# EAGLE schematic OpenTherm_Board_77X (EAGLE 9.6.2)

## Sheet 1 of 7
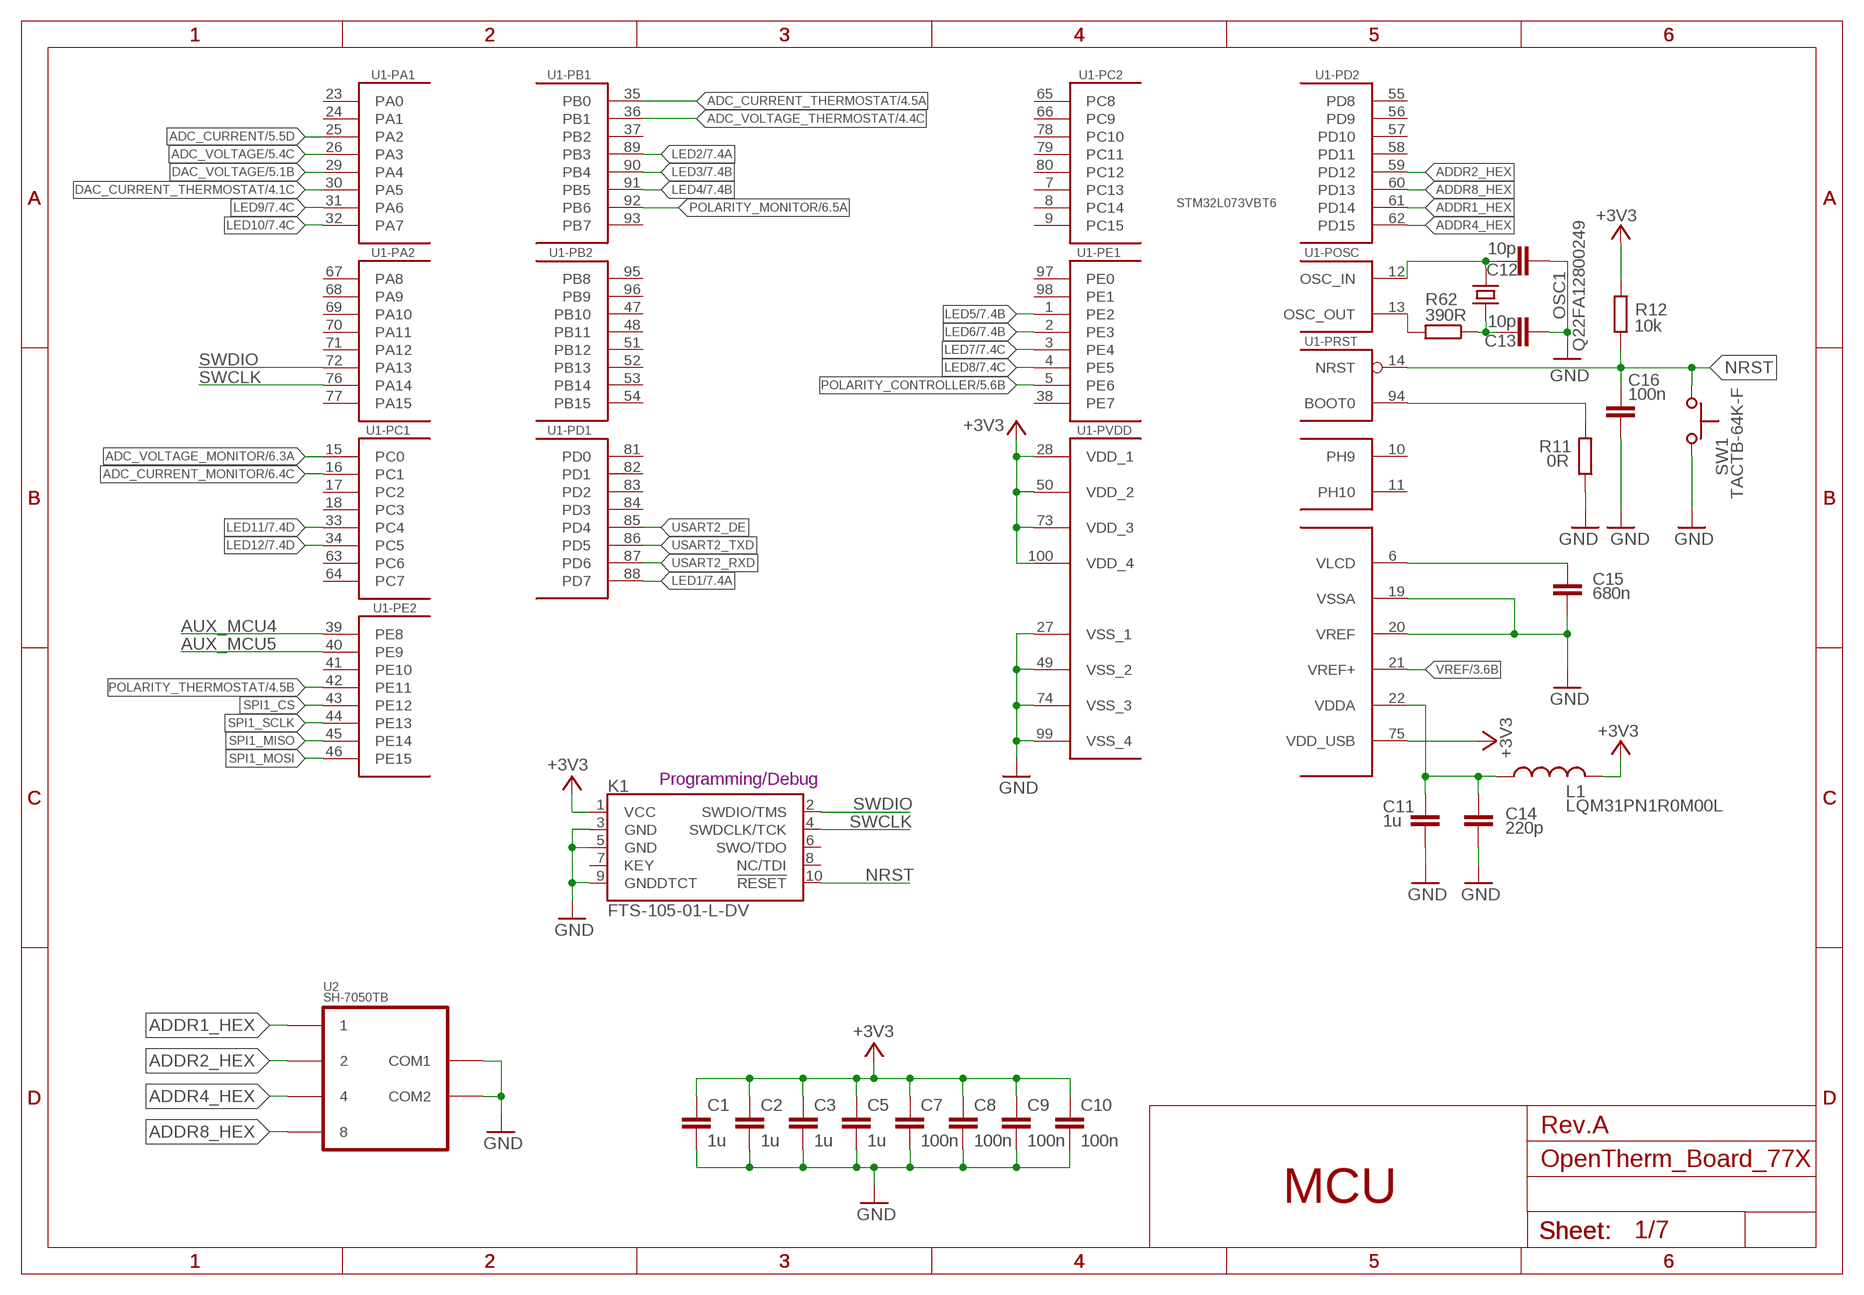
[diagram p0: schematic, sheet 1]

### Parts
C1  1u  C-EUC0805  [C0805]
C2  1u  C-EUC0805  [C0805]
C3  1u  C-EUC0805  [C0805]
C5  1u  C-EUC0805  [C0805]
C7  100n  C-EUC0603  [C0603]
C8  100n  C-EUC0603  [C0603]
C9  100n  C-EUC0603  [C0603]
C10  100n  C-EUC0603  [C0603]
C11  1u  C-EUC0805  [C0805]
C12  10p  C-EUC0603  [C0603]
C13  10p  C-EUC0603  [C0603]
C14  220p  C-EUC0603  [C0603]
C15  680n  C-EUC0603  [C0603:1]
C16  100n  C-EUC0603  [C0603]
K1  FTS-105-01-L-DV  CORTEX_DEBUG_SMD  [SAMTECH_FTSH-105-01]
L1  LQM31PN1R0M00L  L-US  [R1206]
OSC1  Q22FA12800249  [OSCILATOR]
R11  0R  R-EU_R0603  [R0603]
R12  10k  R-EU_R0603  [R0603]
R62  390R  R-EU_R0603  [R0603]
SW1  TACTB-64K-F  [TACTB-64K-F]
U1  STM32L073VBT6  [TQFP100]
U2  SH-7050TB  [HEX_DEC]

### Nets
+3V3: C1.1 C2.1 C3.1 C5.1 C7.1 C8.1 C9.1 C10.1 K1.1(VCC) L1.2 R12.2 U1.28(-PVDD:VDD_1) U1.50(-PVDD:VDD_2) U1.73(-PVDD:VDD_3) U1.75(-PVCC:VDD_USB) U1.100(-PVDD:VDD_4) ; also sheet 2,3,4,5,6,7
ADC_CURRENT: U1.25(-PA1:PA2) ; also sheet 5
ADC_CURRENT_MONITOR: U1.16(-PC1:PC1) ; also sheet 6
ADC_CURRENT_THERMOSTAT: U1.35(-PB1:PB0) ; also sheet 4
ADC_VOLTAGE: U1.26(-PA1:PA3) ; also sheet 5
ADC_VOLTAGE_MONITOR: U1.15(-PC1:PC0) ; also sheet 6
ADC_VOLTAGE_THERMOSTAT: U1.36(-PB1:PB1) ; also sheet 4
ADDR1_HEX: U1.61(-PD2:PD14) U2.1
ADDR2_HEX: U1.59(-PD2:PD12) U2.2
ADDR4_HEX: U1.62(-PD2:PD15) U2.4
ADDR8_HEX: U1.60(-PD2:PD13) U2.8
AUX_MCU4: U1.39(-PE2:PE8)
AUX_MCU5: U1.40(-PE2:PE9)
BOOT: R11.2 U1.94(-PRST:BOOT0)
DAC_CURRENT_THERMOSTAT: U1.30(-PA1:PA5) ; also sheet 4
DAC_VOLTAGE: U1.29(-PA1:PA4) ; also sheet 5
GND: C1.2 C2.2 C3.2 C5.2 C7.2 C8.2 C9.2 C10.2 C11.2 C12.2 C13.2 C14.2 C15.2 C16.2 K1.3(GND) K1.5(GND) K1.9(GNDDTCT) R11.1 SW1.3 U1.19(-PVCC:VSSA) U1.20(-PVCC:VREF) U1.27(-PVDD:VSS_1) U1.49(-PVDD:VSS_2) U1.74(-PVDD:VSS_3) U1.99(-PVDD:VSS_4) U2.C1(COM1) U2.C2(COM2) ; also sheet 2,3,4,5,6
LED1: U1.88(-PD1:PD7) ; also sheet 7
LED2: U1.89(-PB1:PB3) ; also sheet 7
LED3: U1.90(-PB1:PB4) ; also sheet 7
LED4: U1.91(-PB1:PB5) ; also sheet 7
LED5: U1.1(-PE1:PE2) ; also sheet 7
LED6: U1.2(-PE1:PE3) ; also sheet 7
LED7: U1.3(-PE1:PE4) ; also sheet 7
LED8: U1.4(-PE1:PE5) ; also sheet 7
LED9: U1.31(-PA1:PA6) ; also sheet 7
LED10: U1.32(-PA1:PA7) ; also sheet 7
LED11: U1.33(-PC1:PC4) ; also sheet 7
LED12: U1.34(-PC1:PC5) ; also sheet 7
N$2: C15.1 U1.6(-PVCC:VLCD)
NRST: C16.1 K1.10(!RESET) R12.1 SW1.1 U1.14(-PRST:NRST)
OSC: C13.1 OSC1.3 R62.1
OSC+: C12.1 OSC1.1 U1.12(-POSC:OSC_IN)
OSC-: R62.2 U1.13(-POSC:OSC_OUT)
POLARITY_CONTROLLER: U1.5(-PE1:PE6) ; also sheet 5
POLARITY_MONITOR: U1.92(-PB1:PB6) ; also sheet 6
POLARITY_THERMOSTAT: U1.42(-PE2:PE11) ; also sheet 4
SPI1_CS: U1.43(-PE2:PE12)
SPI1_MISO: U1.45(-PE2:PE14)
SPI1_MOSI: U1.46(-PE2:PE15)
SPI1_SCLK: U1.44(-PE2:PE13)
SWCLK: K1.4(SWDCLK/TCK) U1.76(-PA2:PA14)
SWDIO: K1.2(SWDIO/TMS) U1.72(-PA2:PA13)
USART2_DE: U1.85(-PD1:PD4) ; also sheet 2
USART2_RXD: U1.87(-PD1:PD6) ; also sheet 2
USART2_TXD: U1.86(-PD1:PD5) ; also sheet 2
VDDA: C11.1 C14.1 L1.1 U1.22(-PVCC:VDDA)
VREF: U1.21(-PVCC:VREF+) ; also sheet 3,6
Unconnected: K1.6(SWO/TDO) K1.7(KEY) K1.8(NC/TDI) SW1.2(1A) SW1.4(2A) U1.7(-PC2:PC13) U1.8(-PC2:PC14) U1.9(-PC2:PC15) U1.10(-PH:PH9) U1.11(-PH:PH10) U1.17(-PC1:PC2) U1.18(-PC1:PC3) U1.23(-PA1:PA0) U1.24(-PA1:PA1) U1.37(-PB1:PB2) U1.38(-PE1:PE7) U1.41(-PE2:PE10) U1.47(-PB2:PB10) U1.48(-PB2:PB11) U1.51(-PB2:PB12) U1.52(-PB2:PB13) U1.53(-PB2:PB14) U1.54(-PB2:PB15) U1.55(-PD2:PD8) U1.56(-PD2:PD9) U1.57(-PD2:PD10) U1.58(-PD2:PD11) U1.63(-PC1:PC6) U1.64(-PC1:PC7) U1.65(-PC2:PC8) U1.66(-PC2:PC9) U1.67(-PA2:PA8) U1.68(-PA2:PA9) U1.69(-PA2:PA10) U1.70(-PA2:PA11) U1.71(-PA2:PA12) U1.77(-PA2:PA15) U1.78(-PC2:PC10) U1.79(-PC2:PC11) U1.80(-PC2:PC12) U1.81(-PD1:PD0) U1.82(-PD1:PD1) U1.83(-PD1:PD2) U1.84(-PD1:PD3) U1.93(-PB1:PB7) U1.95(-PB2:PB8) U1.96(-PB2:PB9) U1.97(-PE1:PE0) U1.98(-PE1:PE1)

### Notes on the sheet
- Programming/Debug
- Rev.A
- MCU

## Sheet 2 of 7
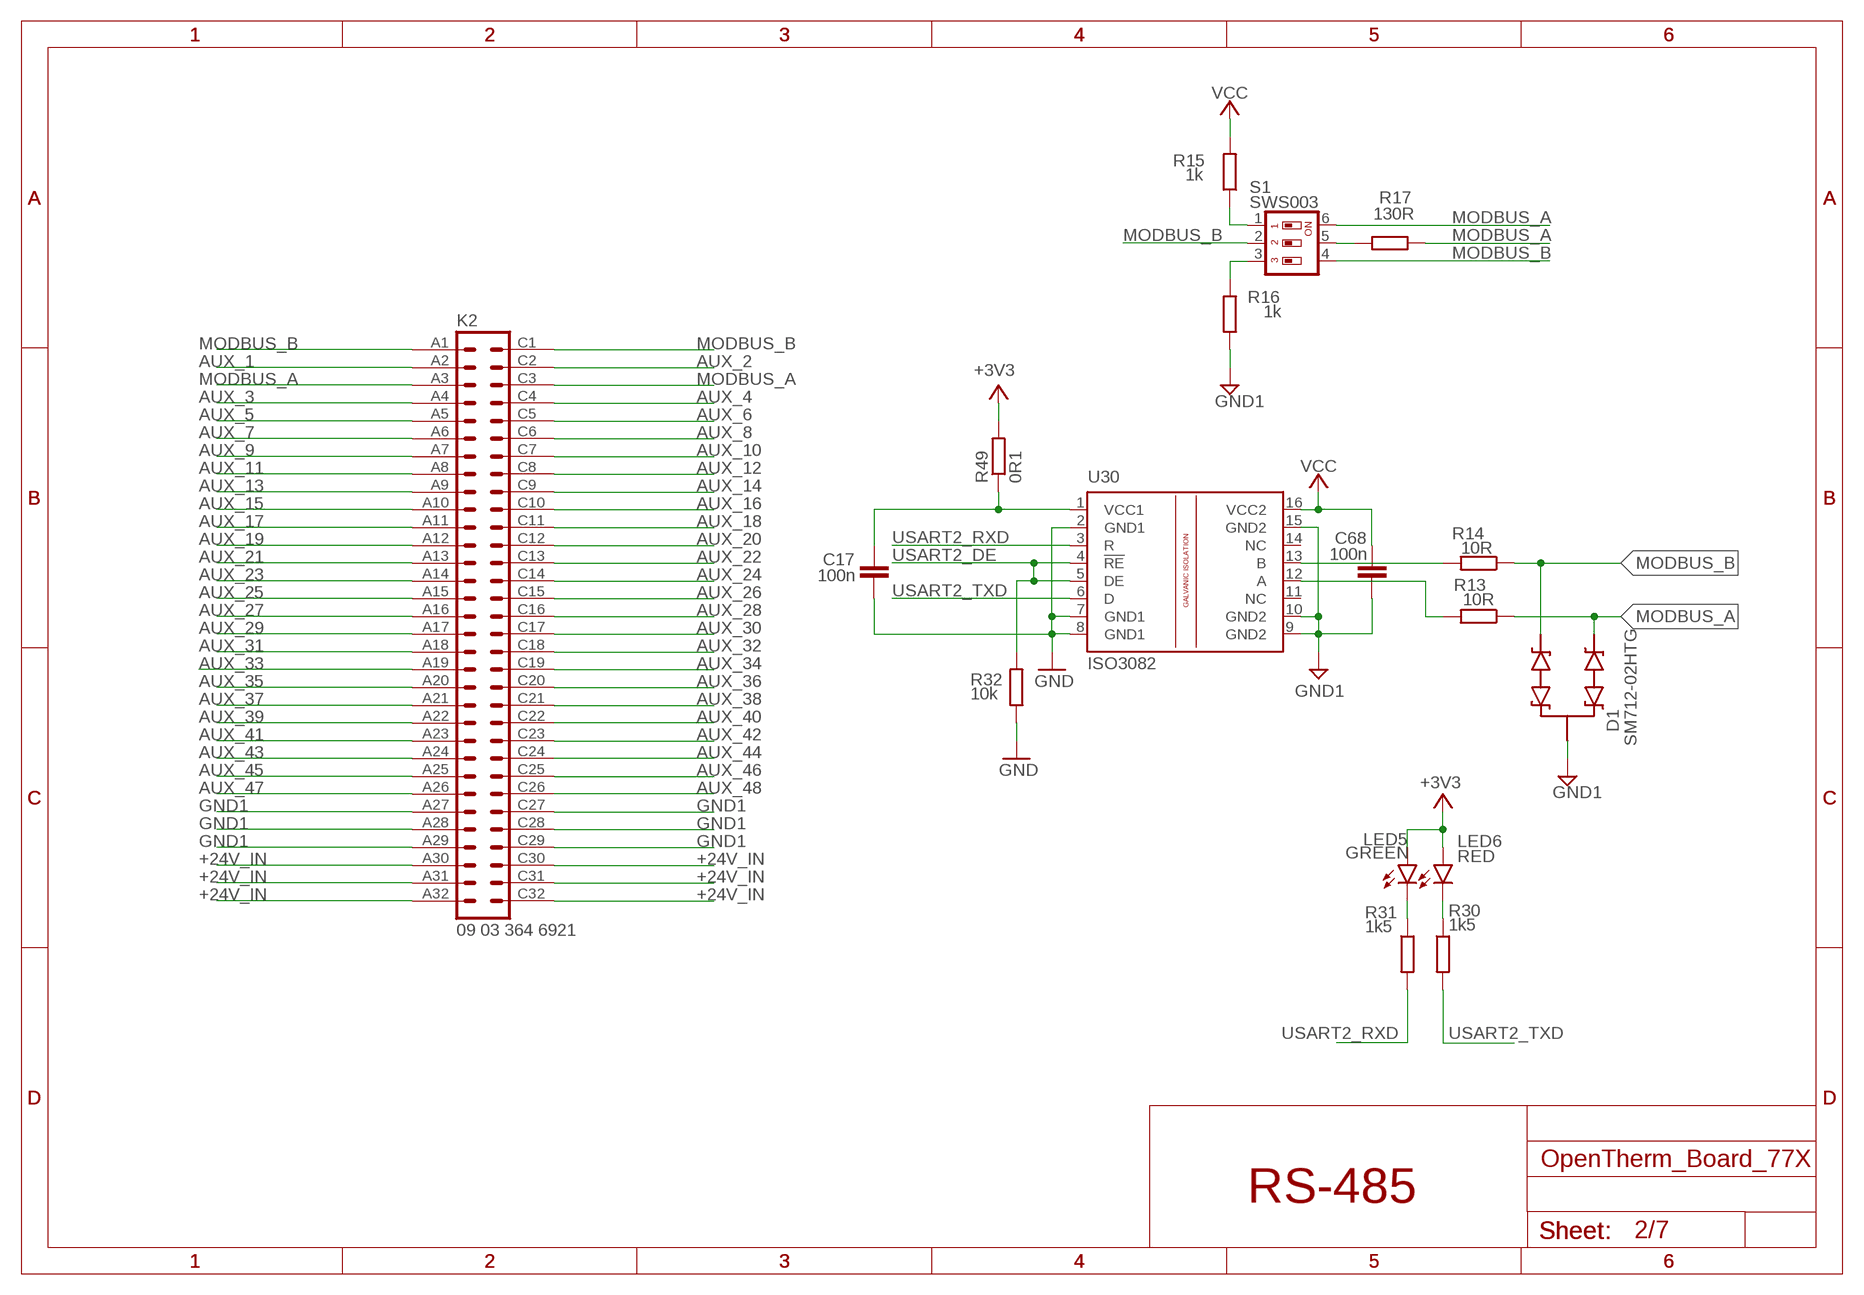
[diagram p1: schematic, sheet 2]

### Parts
C17  100n  C-EUC0805  [C0805]
C68  100n  C-EUC0805  [C0805]
D1  SM712-02HTG  [SOT23-BEC]
K2  09 03 364 6921  VG64P  [VG64P]
LED5  GREEN  LEDCHIPLED_1206  [CHIPLED_1206]
LED6  RED  LEDCHIPLED_1206  [CHIPLED_1206]
R13  10R  R-EU_R0603  [R0603]
R14  10R  R-EU_R0603  [R0603]
R15  1k  R-EU_R1206  [R1206]
R16  1k  R-EU_R1206  [R1206]
R17  130R  R-EU_R1206  [R1206]
R30  1k5  R-EU_R1206  [R1206]
R31  1k5  R-EU_R1206  [R1206]
R32  10k  R-EU_R0603  [R0603]
R49  0R1  R-EU_R1206  [R1206]
S1  SWS003  [SMS-003]
U30  ISO3082  [SO-16DW]

### Nets
+3V3: LED5.A LED6.A R49.2 ; also sheet 1,3,4,5,6,7
+24V_IN: K2.A30 K2.A31 K2.A32 K2.C30 K2.C31 K2.C32 ; also sheet 3
AUX_1: K2.A2
AUX_2: K2.C2
AUX_3: K2.A4
AUX_4: K2.C4
AUX_5: K2.A5
AUX_6: K2.C5
AUX_7: K2.A6
AUX_8: K2.C6
AUX_9: K2.A7
AUX_10: K2.C7
AUX_11: K2.A8
AUX_12: K2.C8
AUX_13: K2.A9
AUX_14: K2.C9
AUX_15: K2.A10
AUX_16: K2.C10
AUX_17: K2.A11
AUX_18: K2.C11
AUX_19: K2.A12
AUX_20: K2.C12
AUX_21: K2.A13
AUX_22: K2.C13
AUX_23: K2.A14
AUX_24: K2.C14
AUX_25: K2.A15
AUX_26: K2.C15
AUX_27: K2.A16
AUX_28: K2.C16
AUX_29: K2.A17
AUX_30: K2.C17
AUX_31: K2.A18
AUX_32: K2.C18
AUX_33: K2.A19
AUX_34: K2.C19
AUX_35: K2.A20
AUX_36: K2.C20
AUX_37: K2.A21
AUX_38: K2.C21
AUX_39: K2.A22
AUX_40: K2.C22
AUX_41: K2.A23
AUX_42: K2.C23
AUX_43: K2.A24
AUX_44: K2.C24
AUX_45: K2.A25
AUX_46: K2.C25
AUX_47: K2.A26
AUX_48: K2.C26
GND: C17.2 R32.1 U30.2(GND1) U30.7(GND1) U30.8(GND1) ; also sheet 1,3,4,5,6
GND1: C68.2 D1.C(E) K2.A27 K2.A28 K2.A29 K2.C27 K2.C28 K2.C29 R16.1 U30.9(GND2) U30.10(GND2) U30.15(GND2) ; also sheet 3
MODBUS_A: D1.E K2.A3 K2.C3 R13.1 R17.1 S1.6
MODBUS_B: D1.B K2.A1 K2.C1 R14.1 S1.2 S1.4
N$7: R14.2 U30.13(B)
N$20: LED5.C R31.1
N$23: R13.2 U30.12(A)
N$34: R15.1 S1.1
N$35: R16.2 S1.3
N$36: R17.2 S1.5
N$37: LED6.C R30.1
N$67: C17.1 R49.1 U30.1(VCC1)
USART2_DE: R32.2 U30.4(!RE) U30.5(DE) ; also sheet 1
USART2_RXD: R31.2 U30.3(R) ; also sheet 1
USART2_TXD: R30.2 U30.6(D) ; also sheet 1
VCC: C68.1 R15.2 U30.16(VCC2) ; also sheet 3
Unconnected: U30.11(NC) U30.14(NC)

### Notes on the sheet
- RS-485

## Sheet 3 of 7
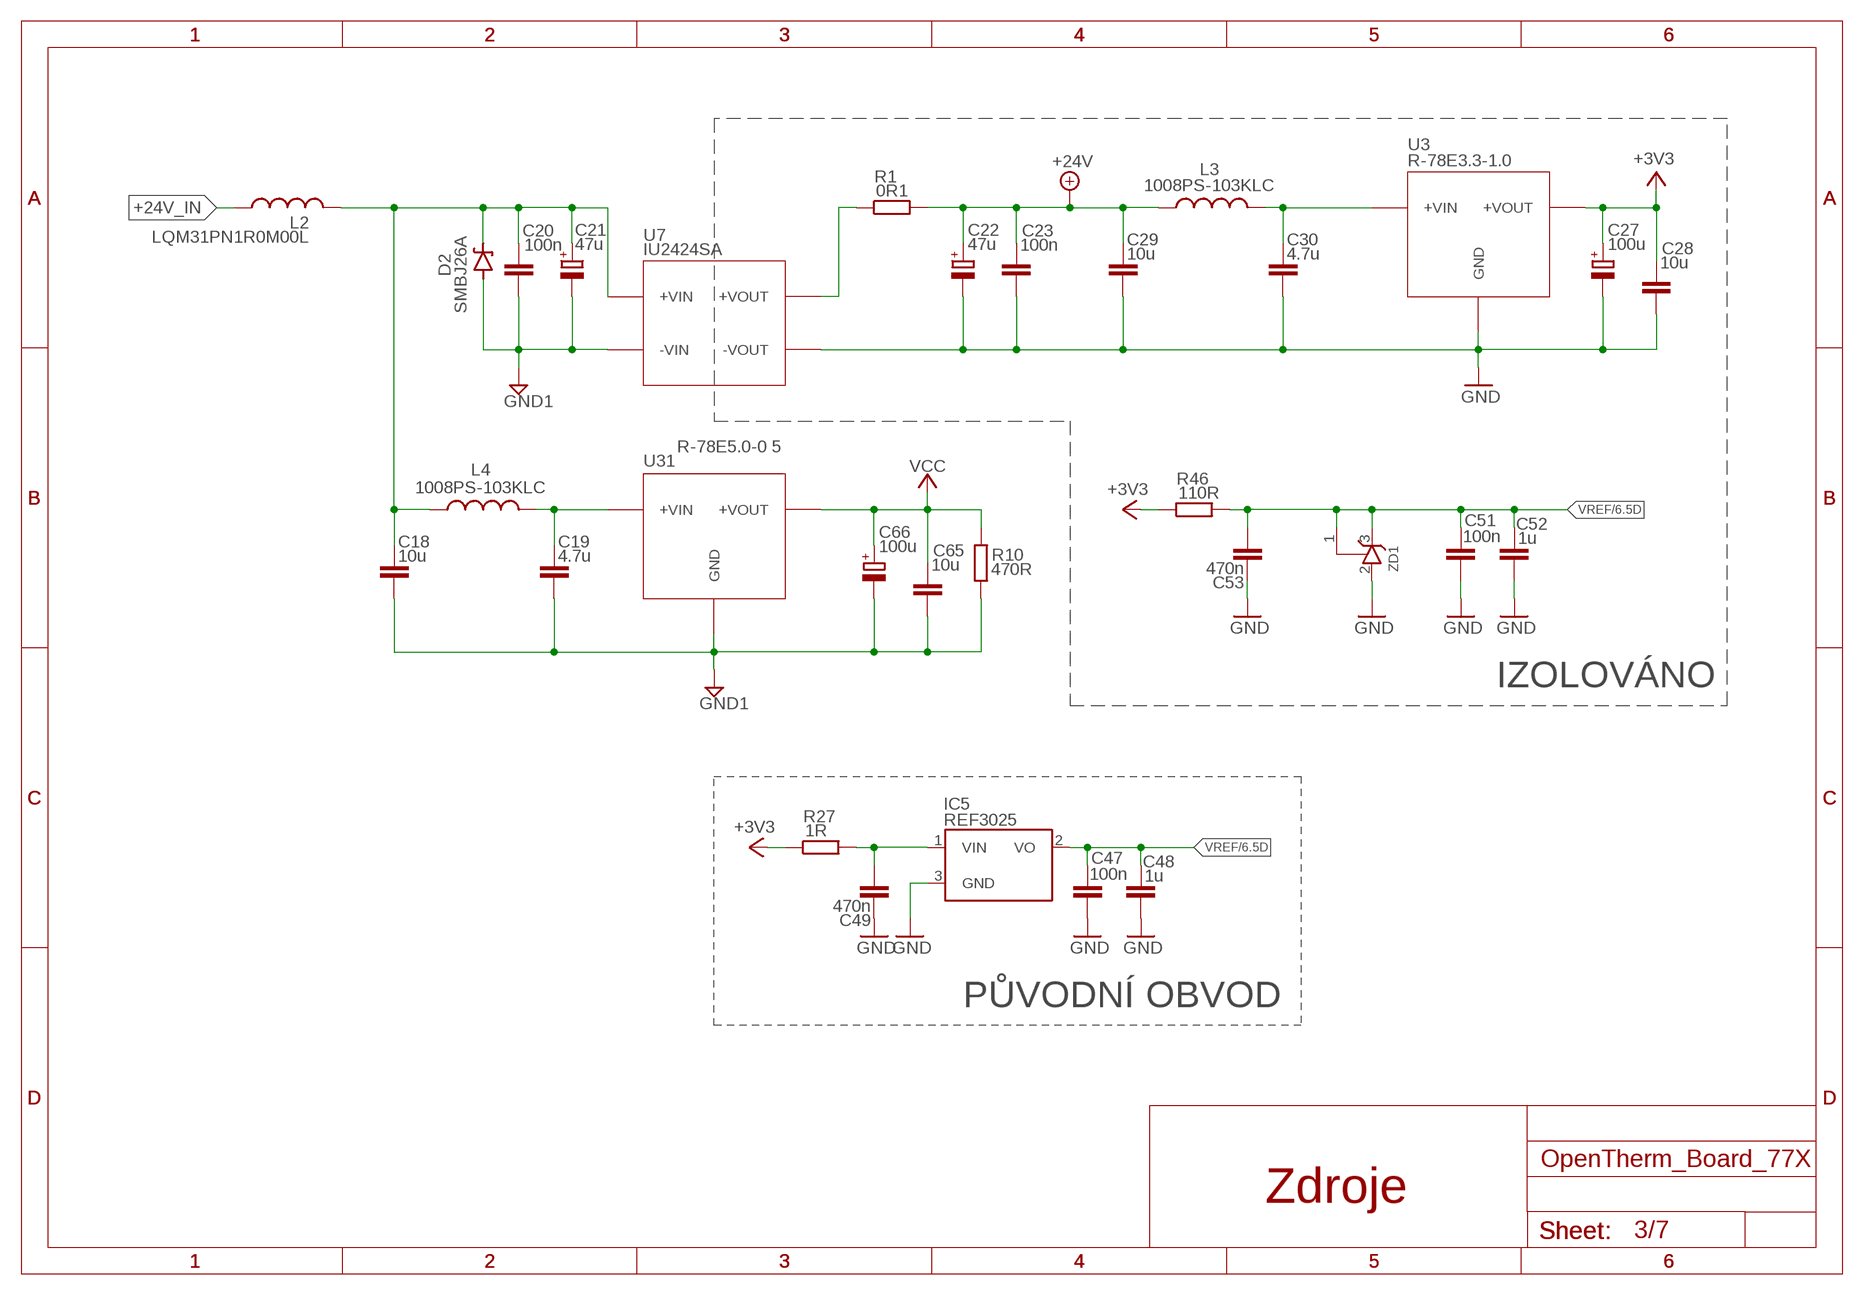
[diagram p2: schematic, sheet 3]

### Parts
C18  10u  C-EUC1206  [C1206]
C19  4.7u  C-EUC1206  [C1206]
C20  100n  C-EUC1206  [C1206]
C21  47u  CPOL-EUE3.5-8  [E3,5-8]
C22  47u  CPOL-EU153CLV-0810  [153CLV-0810]
C23  100n  C-EUC0805  [C0805]
C27  100u  CPOL-EU153CLV-0605  [153CLV-0605]
C28  10u  C-EUC1206  [C1206]
C29  10u  C-EUC1206  [C1206]
C30  4.7u  C-EUC1206  [C1206]
C47  100n  C-EUC0805  [C0805]
C48  1u  C-EUC0805  [C0805]
C49  470n  C-EUC0805  [C0805]
C51  100n  C-EUC0805  [C0805]
C52  1u  C-EUC0805  [C0805]
C53  470n  C-EUC0805  [C0805]
C65  10u  C-EUC1206  [C1206]
C66  100u  CPOL-EU153CLV-0605  [153CLV-0605]
D2  SMBJ26A  [SMB]
IC5  REF3025  MC1525TT  [SOT23]
L2  LQM31PN1R0M00L  L-US  [R1206]
L3  1008PS-103KLC  L-USL1812:1  [L1812]
L4  1008PS-103KLC  L-USL1812:1  [L1812]
R1  0R1  R-EU_R1206  [R1206]
R10  470R  R-EU_R1206  [R1206]
R27  1R  R-EU_R0805  [R0805]
R46  110R  R-EU_R0805  [R0805]
U3  R-78E3.3-1.0  R-78E-0.5  [R-78E-0.5]
U7  IU2424SA  IU2405SA  [IU2405SA]
U31  R-78E5.0-0 5  R-78E-0.5  [R-78E-0.5]
ZD1  TL431INLINE  [TO92-R]

### Nets
+3V3: C27.+ C28.1 R27.1 R46.1 U3.3(+VOUT) ; also sheet 1,2,4,5,6,7
+24V: C22.+ C23.1 C29.1 L3.1 R1.2 ; also sheet 4,5
+24V_IN: L2.1 ; also sheet 2
GND: C22.- C23.2 C27.- C28.2 C29.2 C30.2 C47.2 C48.2 C49.1 C51.2 C52.2 C53.1 IC5.3(GND) U3.2(GND) U7.VOUT-(-VOUT) ZD1.2(A) ; also sheet 1,2,4,5,6
GND1: C18.2 C19.2 C20.2 C21.- C65.2 C66.- D2.A R10.1 U7.VIN-(-VIN) U31.2(GND) ; also sheet 2
N$14: C18.1 C20.1 C21.+ D2.C L2.2 L4.1 U7.VIN+(+VIN)
N$16: C30.1 L3.2 U3.1(+VIN)
N$17: C49.2 IC5.1(VIN) R27.2
N$19: R1.1 U7.VOUT+(+VOUT)
N$63: C19.1 L4.2 U31.1(+VIN)
VCC: C65.1 C66.+ R10.2 U31.3(+VOUT) ; also sheet 2
VREF: C47.1 C48.1 C51.1 C52.1 C53.2 IC5.2(VO) R46.2 ZD1.1(R) ZD1.3(C) ; also sheet 1,6

### Notes on the sheet
- R-78E3.3-1.0
- IU2424SA
- R-78E5.0-0 5
- IZOLOVÁNO
- PŮVODNÍ OBVOD
- Zdroje

## Sheet 4 of 7
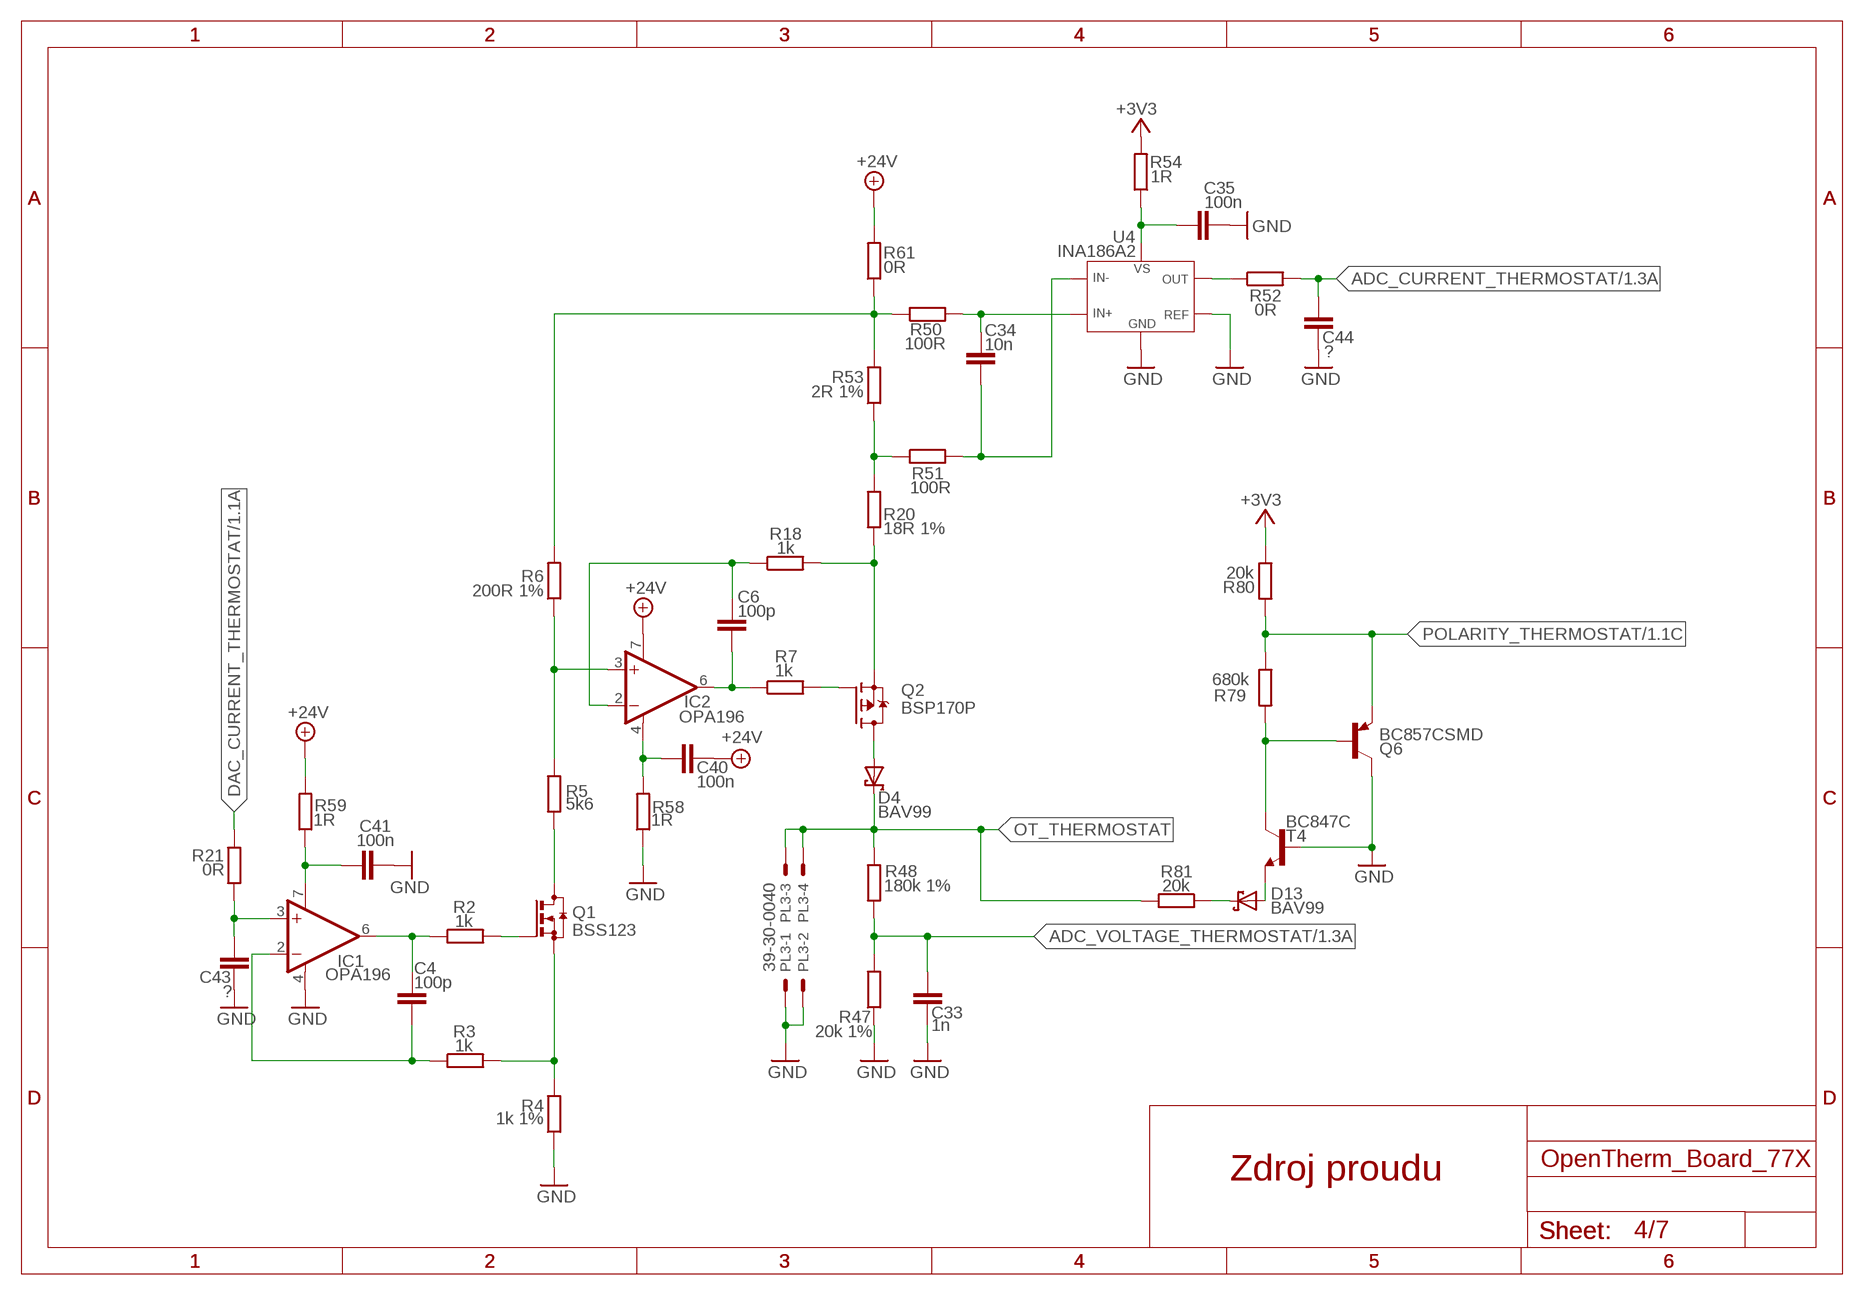
[diagram p3: schematic, sheet 4]

### Parts
C4  100p  C-EUC0805  [C0805]
C6  100p  C-EUC0805  [C0805]
C33  1n  C-EUC0805  [C0805]
C34  10n  C-EUC0805  [C0805]
C35  100n  C-EUC0805  [C0805]
C40  100n  C-EUC0805  [C0805]
C41  100n  C-EUC0805  [C0805]
C43  ?  C-EUC0805  [C0805]
C44  ?  C-EUC0805  [C0805]
D4  BAV99  BAS70  [SOT23]
D13  BAV99  BAS70  [SOT23]
IC1  OPA196  OPA340U  [SO08]
IC2  OPA196  OPA340U  [SO08]
PL3  39-30-0040  555X-4H  [5569-4]
Q1  BSS123  [SOT23]
Q2  BSP170P  [SOT223]
Q6  BC857CSMD  [SOT23-BEC]
R2  1k  R-EU_R0805  [R0805]
R3  1k  R-EU_R0805  [R0805]
R4  1k 1%  R-EU_R0805  [R0805]
R5  5k6  R-EU_R0805  [R0805]
R6  200R 1%  R-EU_R0805  [R0805]
R7  1k  R-EU_R0805  [R0805]
R18  1k  R-EU_R0805  [R0805]
R20  18R 1%  R-EU_R1206  [R1206]
R21  0R  R-EU_R1206  [R1206]
R47  20k 1%  R-EU_R0805  [R0805]
R48  180k 1%  R-EU_R0805  [R0805]
R50  100R  R-EU_R0805  [R0805]
R51  100R  R-EU_R0805  [R0805]
R52  0R  R-EU_R1206  [R1206]
R53  2R 1%  R-EU_R1206  [R1206]
R54  1R  R-EU_R0805  [R0805]
R58  1R  R-EU_R0805  [R0805]
R59  1R  R-EU_R0805  [R0805]
R61  0R  R-EU_R1206  [R1206]
R79  680k  R-EU_R0805  [R0805]
R80  20k  R-EU_R0805  [R0805]
R81  20k  R-EU_R0805  [R0805]
T4  BC847C  BC847  [SOT23]
U4  INA186A2  [SC70-6L]

### Nets
+3V3: R54.2 R80.1 ; also sheet 1,2,3,5,6,7
+24V: C40.1 IC2.7(V+) R59.2 R61.2 ; also sheet 3,5
ADC_CURRENT_THERMOSTAT: C44.1 R52.2 ; also sheet 1
ADC_VOLTAGE_THERMOSTAT: C33.1 R47.2 R48.1 ; also sheet 1
DAC_CURRENT_THERMOSTAT: R21.1 ; also sheet 1
GND: C33.2 C35.2 C41.2 C43.1 C44.2 IC1.4(V-) PL3.1 PL3.2 Q6.C R4.1 R47.1 R58.1 T4.1(B) U4.1(REF) U4.2(GND) ; also sheet 1,2,3,5,6
N$1: IC2.3(+IN) R5.2 R6.1
N$3: Q1.3(D) R5.1
N$4: D4.1(A) Q2.2(D) Q2.4(D)
N$5: Q1.2(S) R3.2 R4.2
N$6: Q1.1(G) R2.2
N$8: C4.1 IC1.6(OUT) R2.1
N$9: C4.2 IC1.2(-IN) R3.1
N$10: C6.2 IC2.6(OUT) R7.1
N$11: C6.1 IC2.2(-IN) R18.1
N$12: Q2.3(S) R18.2 R20.1
N$13: Q2.1(G) R7.2
N$15: C43.2 IC1.3(+IN) R21.2
N$32: R6.2 R50.1 R53.2 R61.1
N$33: C34.1 R50.2 U4.4(IN+)
N$42: C34.2 R51.2 U4.5(IN-)
N$43: R20.2 R51.1 R53.1
N$44: R52.1 U4.6(OUT)
N$45: C35.1 R54.1 U4.3(VS)
N$51: C40.2 IC2.4(V-) R58.2
N$52: C41.1 IC1.7(V+) R59.1
N$74: Q6.B R79.2 T4.3(C)
N$75: D13.1(A) T4.2(E)
N$76: D13.3(C) R81.1
OT_THERMOSTAT: D4.3(C) PL3.3 PL3.4 R48.2 R81.2
POLARITY_THERMOSTAT: Q6.E R79.1 R80.2 ; also sheet 1

### Notes on the sheet
- Zdroj proudu

## Sheet 5 of 7
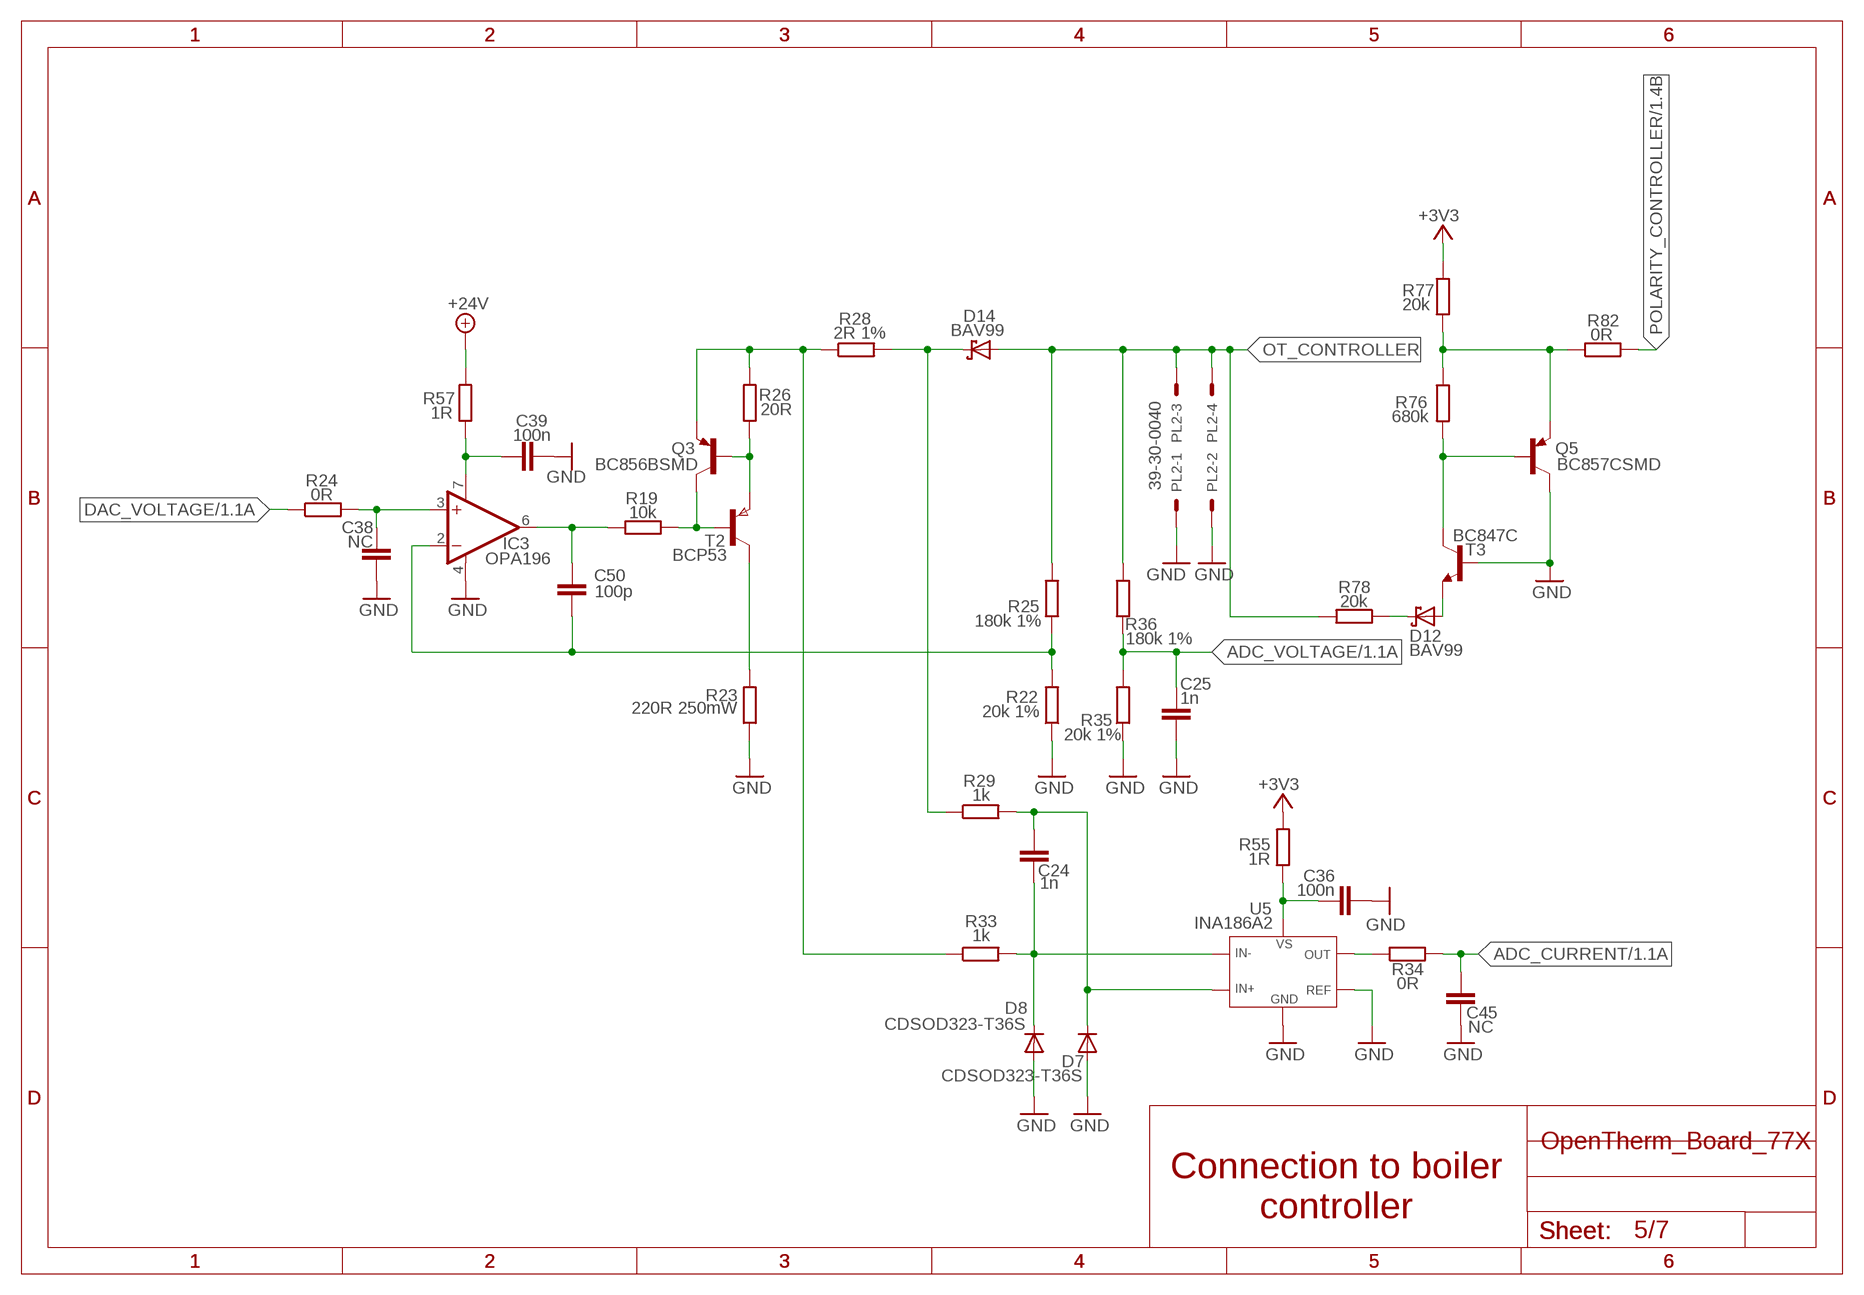
[diagram p4: schematic, sheet 5]

### Parts
C24  1n  C-EUC0805  [C0805]
C25  1n  C-EUC0805  [C0805]
C36  100n  C-EUC0805  [C0805]
C38  NC  C-EUC0805  [C0805]
C39  100n  C-EUC0805  [C0805]
C45  NC  C-EUC0805  [C0805]
C50  100p  C-EUC0805  [C0805]
D7  CDSOD323-T36S  DIODE-SOD323-W  [SOD323-W]
D8  CDSOD323-T36S  DIODE-SOD323-W  [SOD323-W]
D12  BAV99  BAS70  [SOT23]
D14  BAV99  BAS70  [SOT23]
IC3  OPA196  OPA340U  [SO08]
PL2  39-30-0040  555X-4H  [5569-4]
Q3  BC856BSMD  [SOT23-BEC]
Q5  BC857CSMD  [SOT23-BEC]
R19  10k  R-EU_R0805  [R0805]
R22  20k 1%  R-EU_R0805  [R0805]
R23  220R 250mW  R-EU_R1206  [R1206]
R24  0R  R-EU_R1206  [R1206]
R25  180k 1%  R-EU_R0805  [R0805]
R26  20R  R-EU_R1206  [R1206]
R28  2R 1%  R-EU_R1206  [R1206]
R29  1k  R-EU_R0805  [R0805]
R33  1k  R-EU_R0805  [R0805]
R34  0R  R-EU_R1206  [R1206]
R35  20k 1%  R-EU_R0805  [R0805]
R36  180k 1%  R-EU_R0805  [R0805]
R55  1R  R-EU_R0805  [R0805]
R57  1R  R-EU_R1206  [R1206]
R76  680k  R-EU_R0805  [R0805]
R77  20k  R-EU_R0805  [R0805]
R78  20k  R-EU_R0805  [R0805]
R82  0R  R-EU_R1206  [R1206]
T2  BCP53  PNPSOT223  [SOT223]
T3  BC847C  BC847  [SOT23]
U5  INA186A2  [SC70-6L]

### Nets
+3V3: R55.2 R77.1 ; also sheet 1,2,3,4,6,7
+24V: R57.2 ; also sheet 3,4
ADC_CURRENT: C45.1 R34.2 ; also sheet 1
ADC_VOLTAGE: C25.1 R35.2 R36.1 ; also sheet 1
DAC_VOLTAGE: R24.1 ; also sheet 1
GND: C25.2 C36.2 C38.1 C39.2 C45.2 D7.A D8.A IC3.4(V-) PL2.1 PL2.2 Q5.C R22.1 R23.1 R35.1 T3.1(B) U5.1(REF) U5.2(GND) ; also sheet 1,2,3,4,6
N$18: R23.2 T2.2(C) T2.4(C)
N$21: C50.2 IC3.6(OUT) R19.1
N$22: C50.1 IC3.2(-IN) R22.2 R25.1
N$24: C38.2 IC3.3(+IN) R24.2
N$25: Q3.C R19.2 T2.1(B)
N$26: Q3.B R26.1 T2.3(E)
N$27: Q3.E R26.2 R28.1 R33.1
N$28: D14.3(C) R28.2 R29.1
N$29: C24.1 D7.C R29.2 U5.4(IN+)
N$30: C24.2 D8.C R33.2 U5.5(IN-)
N$41: Q5.B R76.2 T3.3(C)
N$46: R34.1 U5.6(OUT)
N$47: C36.1 R55.1 U5.3(VS)
N$50: C39.1 IC3.7(V+) R57.1
N$72: D12.1(A) T3.2(E)
N$73: D12.3(C) R78.1
N$77: Q5.E R76.1 R77.2 R82.1
OT_CONTROLLER: D14.1(A) PL2.3 PL2.4 R25.2 R36.2 R78.2
POLARITY_CONTROLLER: R82.2 ; also sheet 1

### Notes on the sheet
- Connection to boiler
  controller

## Sheet 6 of 7
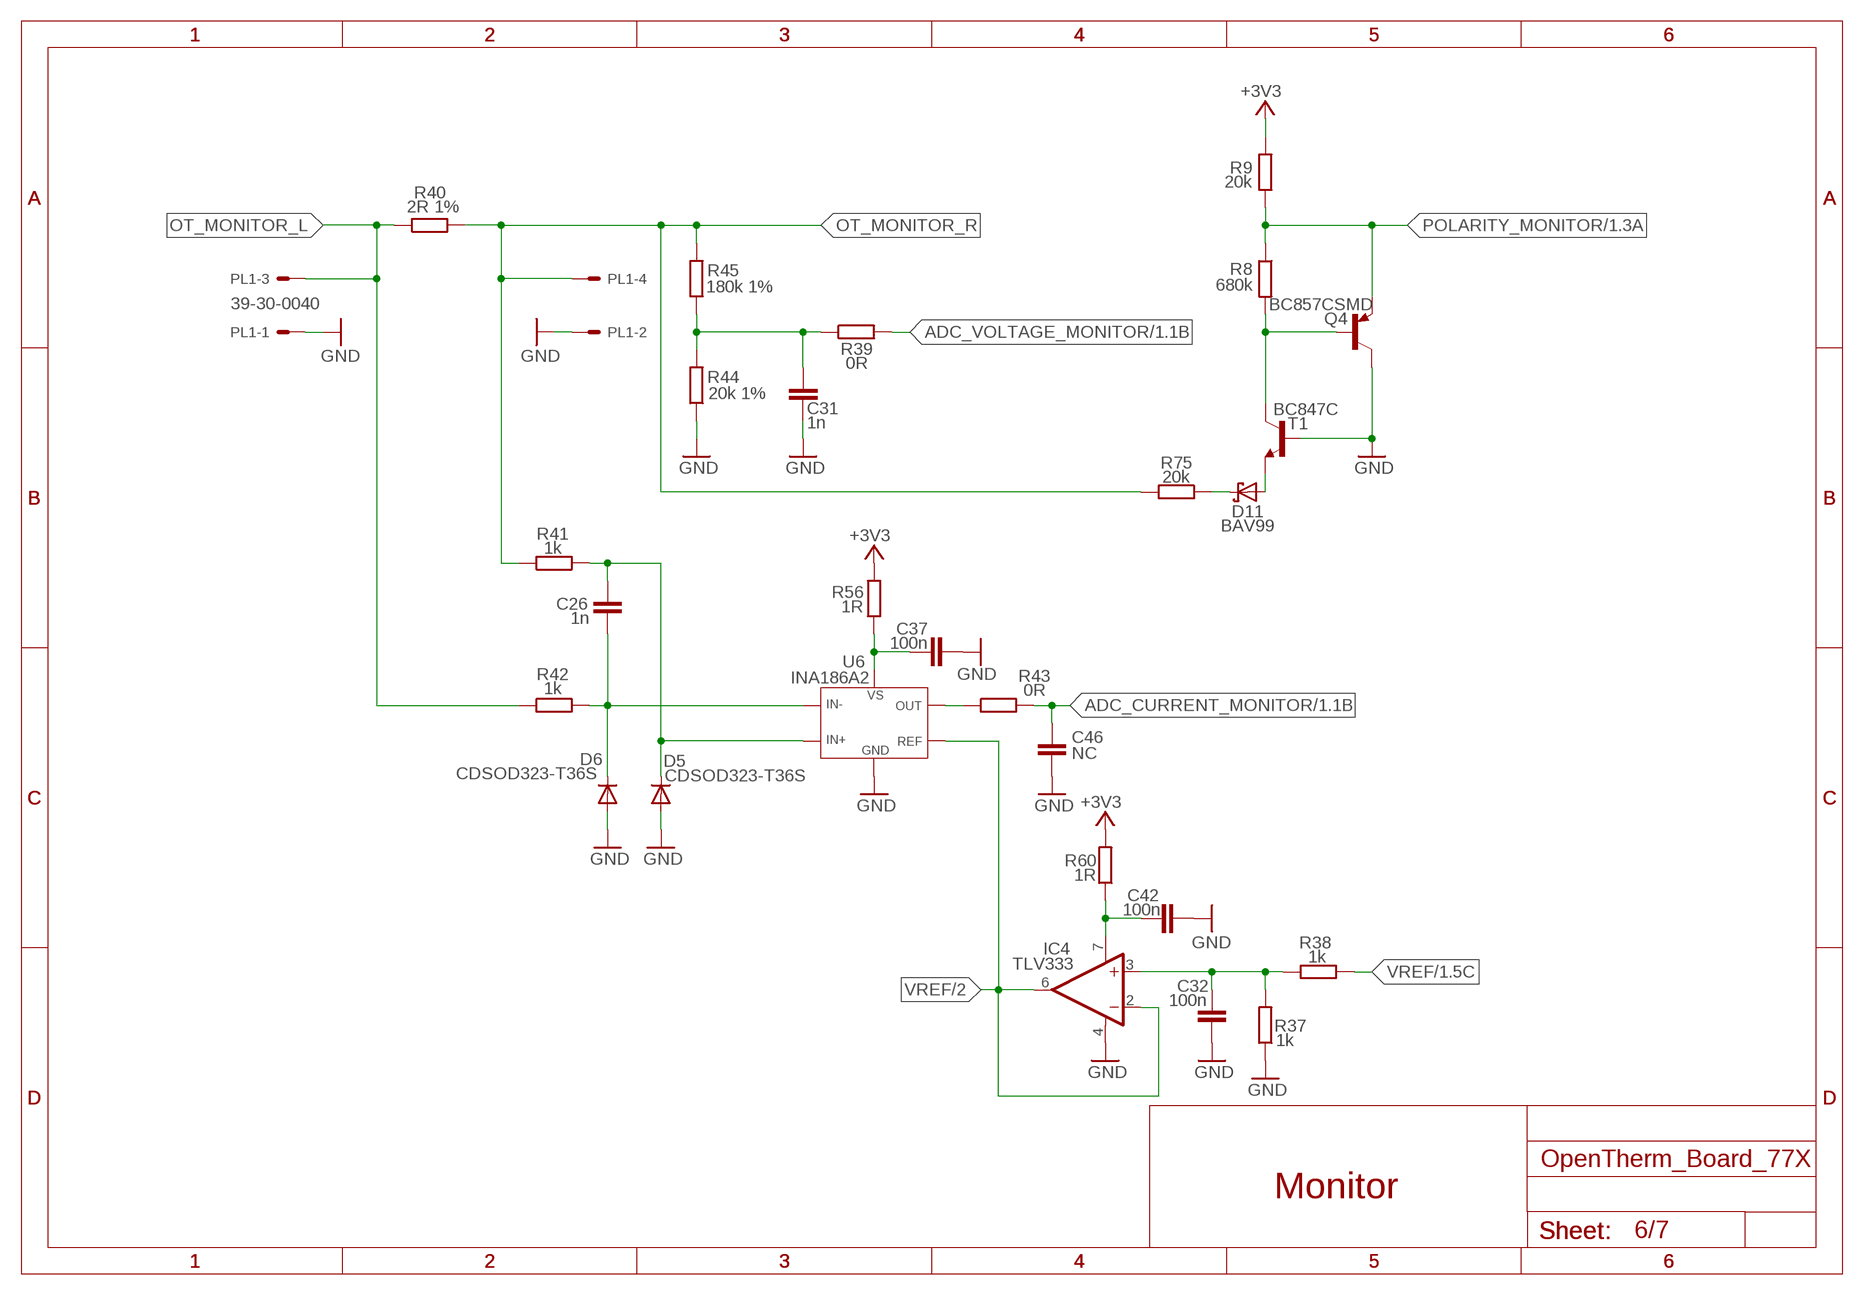
[diagram p5: schematic, sheet 6]

### Parts
C26  1n  C-EUC0805  [C0805]
C31  1n  C-EUC0805  [C0805]
C32  100n  C-EUC0805  [C0805]
C37  100n  C-EUC0805  [C0805]
C42  100n  C-EUC0805  [C0805]
C46  NC  C-EUC0805  [C0805]
D5  CDSOD323-T36S  DIODE-SOD323-W  [SOD323-W]
D6  CDSOD323-T36S  DIODE-SOD323-W  [SOD323-W]
D11  BAV99  BAS70  [SOT23]
IC4  TLV333  OPA340U  [SO08]
PL1  39-30-0040  555X-4H  [5569-4]
Q4  BC857CSMD  [SOT23-BEC]
R8  680k  R-EU_R0805  [R0805]
R9  20k  R-EU_R0805  [R0805]
R37  1k  R-EU_R1206  [R1206]
R38  1k  R-EU_R1206  [R1206]
R39  0R  R-EU_R1206  [R1206]
R40  2R 1%  R-EU_R1206  [R1206]
R41  1k  R-EU_R0805  [R0805]
R42  1k  R-EU_R0805  [R0805]
R43  0R  R-EU_R1206  [R1206]
R44  20k 1%  R-EU_R0805  [R0805]
R45  180k 1%  R-EU_R0805  [R0805]
R56  1R  R-EU_R0805  [R0805]
R60  1R  R-EU_R0805  [R0805]
R75  20k  R-EU_R0805  [R0805]
T1  BC847C  BC847  [SOT23]
U6  INA186A2  [SC70-6L]

### Nets
+3V3: R9.1 R56.2 R60.2 ; also sheet 1,2,3,4,5,7
ADC_CURRENT_MONITOR: C46.1 R43.2 ; also sheet 1
ADC_VOLTAGE_MONITOR: R39.2 ; also sheet 1
GND: C31.2 C32.1 C37.2 C42.2 C46.2 D5.A D6.A IC4.4(V-) PL1.1 PL1.2 Q4.C R37.1 R44.1 T1.1(B) U6.2(GND) ; also sheet 1,2,3,4,5
N$38: C32.2 IC4.3(+IN) R37.2 R38.1
N$39: C26.1 D5.C R41.2 U6.4(IN+)
N$40: C26.2 D6.C R42.2 U6.5(IN-)
N$48: R43.1 U6.6(OUT)
N$49: C37.1 R56.1 U6.3(VS)
N$53: C42.1 IC4.7(V+) R60.1
N$54: Q4.B R8.2 T1.3(C)
N$61: D11.1(A) T1.2(E)
N$62: D11.3(C) R75.1
N$71: C31.1 R39.1 R44.2 R45.1
OT_MONITOR_L: PL1.3 R40.1 R42.1
OT_MONITOR_R: PL1.4 R40.2 R41.1 R45.2 R75.2
POLARITY_MONITOR: Q4.E R8.1 R9.2 ; also sheet 1
VREF: R38.2 ; also sheet 1,3
VREF/2: IC4.2(-IN) IC4.6(OUT) U6.1(REF)

### Notes on the sheet
- Monitor

## Sheet 7 of 7
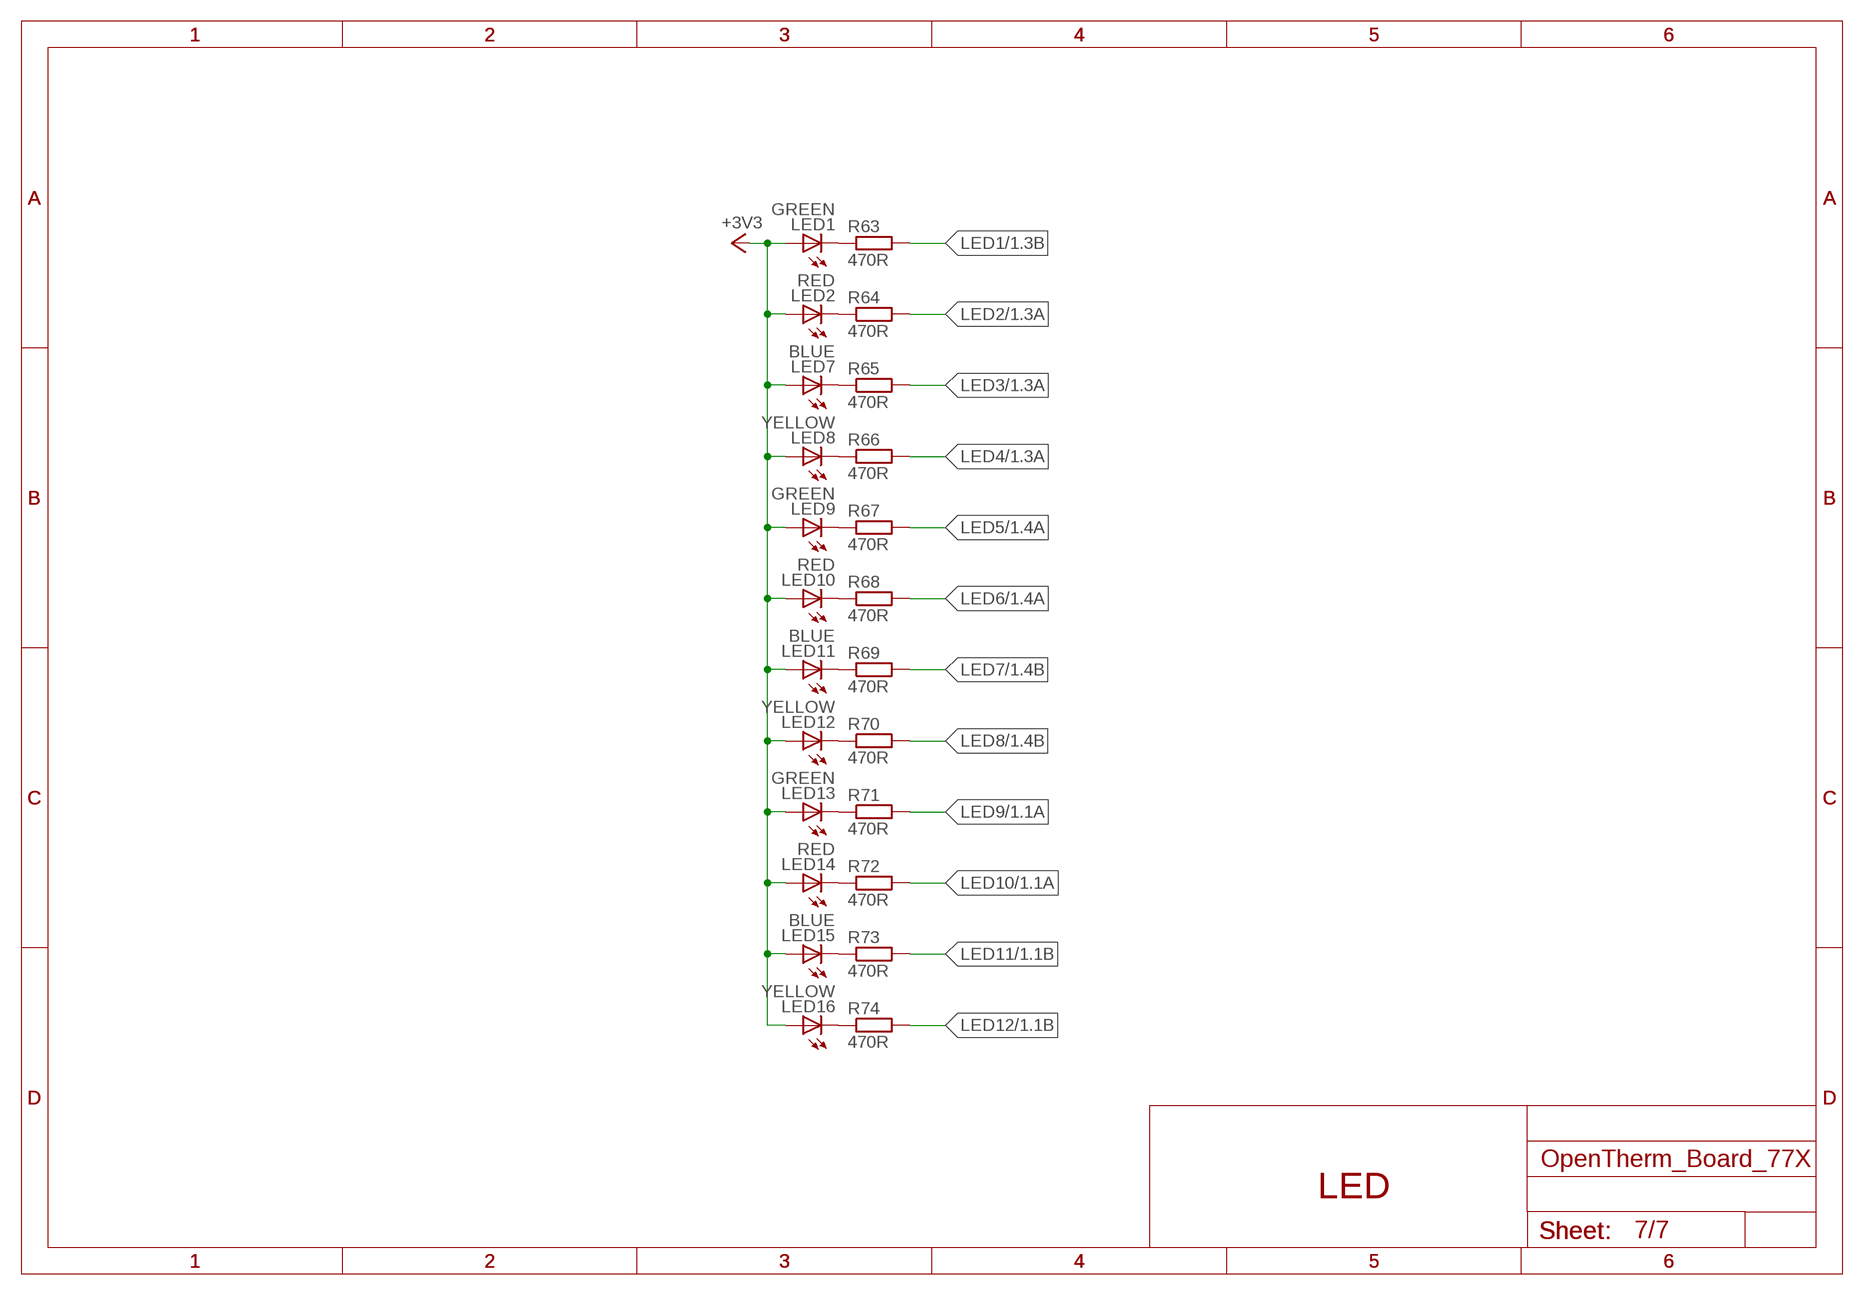
[diagram p6: schematic, sheet 7]

### Parts
LED1  GREEN  LED3MM  [LED3MM]
LED2  RED  LED3MM  [LED3MM]
LED7  BLUE  LED3MM  [LED3MM]
LED8  YELLOW  LED3MM  [LED3MM]
LED9  GREEN  LED3MM  [LED3MM]
LED10  RED  LED3MM  [LED3MM]
LED11  BLUE  LED3MM  [LED3MM]
LED12  YELLOW  LED3MM  [LED3MM]
LED13  GREEN  LED3MM  [LED3MM]
LED14  RED  LED3MM  [LED3MM]
LED15  BLUE  LED3MM  [LED3MM]
LED16  YELLOW  LED3MM  [LED3MM]
R63  470R  R-EU_R1206  [R1206]
R64  470R  R-EU_R1206  [R1206]
R65  470R  R-EU_R1206  [R1206]
R66  470R  R-EU_R1206  [R1206]
R67  470R  R-EU_R1206  [R1206]
R68  470R  R-EU_R1206  [R1206]
R69  470R  R-EU_R1206  [R1206]
R70  470R  R-EU_R1206  [R1206]
R71  470R  R-EU_R1206  [R1206]
R72  470R  R-EU_R1206  [R1206]
R73  470R  R-EU_R1206  [R1206]
R74  470R  R-EU_R1206  [R1206]

### Nets
+3V3: LED1.A LED2.A LED7.A LED8.A LED9.A LED10.A LED11.A LED12.A LED13.A LED14.A LED15.A LED16.A ; also sheet 1,2,3,4,5,6
LED1: R63.2 ; also sheet 1
LED2: R64.2 ; also sheet 1
LED3: R65.2 ; also sheet 1
LED4: R66.2 ; also sheet 1
LED5: R67.2 ; also sheet 1
LED6: R68.2 ; also sheet 1
LED7: R69.2 ; also sheet 1
LED8: R70.2 ; also sheet 1
LED9: R71.2 ; also sheet 1
LED10: R72.2 ; also sheet 1
LED11: R73.2 ; also sheet 1
LED12: R74.2 ; also sheet 1
N$55: LED1.K(C) R63.1
N$56: LED2.K(C) R64.1
N$57: LED7.K(C) R65.1
N$58: LED8.K(C) R66.1
N$59: LED9.K(C) R67.1
N$60: LED10.K(C) R68.1
N$64: LED11.K(C) R69.1
N$65: LED12.K(C) R70.1
N$66: LED13.K(C) R71.1
N$68: LED14.K(C) R72.1
N$69: LED15.K(C) R73.1
N$70: LED16.K(C) R74.1

### Notes on the sheet
- LED

## Library data of the parts
C1-C11 C13 C14 C16-C20 C23-C26 C28-C53 C65 C68 = rcl:C-EU: CAPACITOR, European symbol
C12 = NTC_Board:C-EU: CAPACITOR, European symbol; SPICEPREFIX: C
C15 = NTC_Board:C-EU*?: CAPACITOR, European symbol; SPICEPREFIX: C
C21 C27 C66 = rcl:CPOL-EU: POLARIZED CAPACITOR, European symbol; SPICEPREFIX: C
C22 = rcl@1:CPOL-EU: POLARIZED CAPACITOR, European symbol; SPICEPREFIX: C
D1 = NTC_Board_REVB:SM712-02HTG; OC_FARNELL: 2749175
D2 = NTC_Board_REVB:SMBJ26A; OC_FARNELL: 1827615
D4 D11-D14 = diode:BAS70: Silicon Schottky Diodes General-purpose diode for high-speed switching
D5-D8 = diode:DIODE-: DIODE
IC1-IC4 = burr-brown:OPA340: Rail-to-Rail Operational Amplifiers Single-Supply, MicroAmplifier(TM) Series; MPN: OPA340UA; OC_FARNELL: 1106196; OC_NEWARK: 24M5449
IC5 = microchip:MC15*: 2.5V and 4.096V Voltage References Source: http://www.microchip.com .. 21653b.pdf; OC_FARNELL: unknown; OC_NEWARK: unknown
K1 = NTC_Board:CORTEX_DEBUG: Cortex Debug Connector - 10 pin Supports JTAG debug, Serial Wire debug, and Serial Wire Viewer. PTH and SMD connector options available. General Connector Information <http://infocenter.arm.com/help/topic/com.arm.doc.faqs/attached/13634/cortex_debug_connectors.pdf> Products: PTH Connector <http://www.digikey.com/product-detail/en/cnc-tech/3220-10-0100-00/1175-1627-ND/3883661> -via Digi-Key SparkFun PSoc <https://www.sparkfun.com/products/13229> SparkFun T <https://www.sparkfun.com/products/13810>; OC_FARNELL: 1667729
K2 = NTC_Board_REVB:VG64: PCB EUROCARD, 64-pin type C/AC, 2.54 mm Typically use package VG64P.; OC_FARNELL: 1096949
L1 L2 = NTC_Board:L-US: INDUCTOR, American symbol; OC_FARNELL: 2470292; SPICEPREFIX: L
L3 L4 = Input_board:L-US*?:1: INDUCTOR, American symbol; OC_FARNELL: 2286876; SPICEPREFIX: L
LED1 LED2 LED7-LED16 = led:LED: LED OSRAM: - CHIPLED LG R971, LG N971, LY N971, LG Q971, LY Q971, LO R971, LY R971 LH N974, LH R974 LS Q976, LO Q976, LY Q976 LO Q996 - Hyper CHIPLED LW Q18S LB Q993, LB Q99A, LB R99A - SideLED LS A670, LO A670, LY A670, LG A670, LP A670 LB A673, LV A673, LT A673, LW A673 LH A674 LY A675 LS A676, LA A676, LO A676, LY A676, LW A676 LS A679, LY A679, LG A679 - Hyper Micro SIDELED® LS Y876, LA Y876, LO Y876, LY Y876 LT Y87S - SmartLED LW L88C, LW L88S LB L89C, LB L89S, LG L890 LS L89K, LO L89K, LY L89K LS L896, LA L896, LO L896, LY L896 - TOPLED LS T670, LO T670, LY T670, LG T670, LP T670 LSG T670, LSP T670, LSY T670, LOP T670, LYG T670 LG T671, LOG T671, LSG T671 LB T673, LV T673, LT T673, LW T673 LH T674 LS T676, LA T676, LO T676, LY T676, LB T676, LH T676, LSB T676, LW T676 LB T67C, LV T67C, LT T67C, LS T67K, LO T67K, LY T67K, LW E67C LS E67B, LA E67B, LO E67B, LY E67B, LB E67C, LV E67C, LT E67C LW T67C LS T679, LY T679, LG T679 LS T770, LO T770, LY T770, LG T770, LP T770 LB T773, LV T773, LT T773, LW T773 LH T774 LS E675, LA E675, LY E675, LS T675 LS T776, LA T776, LO T776, LY T776, LB T776 LHGB T686 LT T68C, LB T68C - Hyper Mini TOPLED® LB M676 - Mini TOPLED Santana® LG M470 LS M47K, LO M47K, LY M47K Source: http://www.osram.convergy.de LUXEON: - LUMILED® LXK2-PW12-R00, LXK2-PW12-S00, LXK2-PW14-U00, LXK2-PW14-V00 LXK2-PM12-R00, LXK2-PM12-S00, LXK2-PM14-U00 LXK2-PE12-Q00, LXK2-PE12-R00, LXK2-PE12-S00, LXK2-PE14-T00, LXK2-PE14-U00 LXK2-PB12-K00, LXK2-PB12-L00, LXK2-PB12-M00, LXK2-PB14-N00, LXK2-PB14-P00, LXK2-PB14-Q00 LXK2-PR12-L00, LXK2-PR12-M00, LXK2-PR14-Q00, LXK2-PR14-R00 LXK2-PD12-Q00, LXK2-PD12-R00, LXK2-PD12-S00 LXK2-PH12-R00, LXK2-PH12-S00 LXK2-PL12-P00, LXK2-PL12-Q00, LXK2-PL12-R00 Source: www.luxeon.com KINGBRIGHT: KA-3528ASYC Source: www.kingbright.com
LED5 LED6 = NTC_Board:LED: LED OSRAM: - CHIPLED LG R971, LG N971, LY N971, LG Q971, LY Q971, LO R971, LY R971 LH N974, LH R974 LS Q976, LO Q976, LY Q976 LO Q996 - Hyper CHIPLED LW Q18S LB Q993, LB Q99A, LB R99A - SideLED LS A670, LO A670, LY A670, LG A670, LP A670 LB A673, LV A673, LT A673, LW A673 LH A674 LY A675 LS A676, LA A676, LO A676, LY A676, LW A676 LS A679, LY A679, LG A679 - Hyper Micro SIDELED® LS Y876, LA Y876, LO Y876, LY Y876 LT Y87S - SmartLED LW L88C, LW L88S LB L89C, LB L89S, LG L890 LS L89K, LO L89K, LY L89K LS L896, LA L896, LO L896, LY L896 - TOPLED LS T670, LO T670, LY T670, LG T670, LP T670 LSG T670, LSP T670, LSY T670, LOP T670, LYG T670 LG T671, LOG T671, LSG T671 LB T673, LV T673, LT T673, LW T673 LH T674 LS T676, LA T676, LO T676, LY T676, LB T676, LH T676, LSB T676, LW T676 LB T67C, LV T67C, LT T67C, LS T67K, LO T67K, LY T67K, LW E67C LS E67B, LA E67B, LO E67B, LY E67B, LB E67C, LV E67C, LT E67C LW T67C LS T679, LY T679, LG T679 LS T770, LO T770, LY T770, LG T770, LP T770 LB T773, LV T773, LT T773, LW T773 LH T774 LS E675, LA E675, LY E675, LS T675 LS T776, LA T776, LO T776, LY T776, LB T776 LHGB T686 LT T68C, LB T68C - Hyper Mini TOPLED® LB M676 - Mini TOPLED Santana® LG M470 LS M47K, LO M47K, LY M47K Source: http://www.osram.convergy.de LUXEON: - LUMILED® LXK2-PW12-R00, LXK2-PW12-S00, LXK2-PW14-U00, LXK2-PW14-V00 LXK2-PM12-R00, LXK2-PM12-S00, LXK2-PM14-U00 LXK2-PE12-Q00, LXK2-PE12-R00, LXK2-PE12-S00, LXK2-PE14-T00, LXK2-PE14-U00 LXK2-PB12-K00, LXK2-PB12-L00, LXK2-PB12-M00, LXK2-PB14-N00, LXK2-PB14-P00, LXK2-PB14-Q00 LXK2-PR12-L00, LXK2-PR12-M00, LXK2-PR14-Q00, LXK2-PR14-R00 LXK2-PD12-Q00, LXK2-PD12-R00, LXK2-PD12-S00 LXK2-PH12-R00, LXK2-PH12-S00 LXK2-PL12-P00, LXK2-PL12-Q00, LXK2-PL12-R00 Source: www.luxeon.com KINGBRIGHT: KA-3528ASYC Source: www.kingbright.com
OSC1 = NTC_Board:Q22FA12800249; OC_FARNELL: 2723223
PL1-PL3 = con-molex-2:555X-4: Mini FIT connector 4 way; OC_FARNELL: 1697133
Q1 = transistor-small-signal:BSS123: N-CHANNEL MOS FET
Q2 = transistor-fet:BSP170P: SIPMOS(R) Small-Signal-Transistor P-Channel, Enhancement mode Source: http://www.infineon.com/upload/Document/BSP170P_Rev2.4.pdf
Q3 = transistor-pnp:BC856*: PNP Transistror
Q4-Q6 = transistor-pnp:BC857*: PNP Transistror
R1-R12 R15-R82 = rcl:R-EU_: RESISTOR, European symbol
R13 R14 = rcl:R-EU_: RESISTOR, European symbol; OC_FARNELL: 2887146
S1 = NTC_Board_REVB:SWS003: SMD Dip Switch 3 pol.; OC_FARNELL: 1524006
SW1 = NTC_Board_REVB:TACTB-64K-F: microSWITCH - 0,5A/12V SMD
T1 T3 T4 = transistor-neu-to92:BC847: NPN TRANSISTOR
T2 = zetex:PNPSOT223: PNP TRANSISTOR; MPN: DJT4030P-13; OC_FARNELL: 1710675; OC_NEWARK: 25R4489
U1 = NTC_Board_REVB:STM32L073VBT6; OC_FARNELL: 3132645
U2 = NTC_Board_REVB:SH-7050TB; OC_FARNELL: 2854802
U3 U31 = Relay_Board_REVB:R-78E-0.5; OC_FARNELL: 2078564
U4-U6 = maxim:INA186A2
U7 = NTC_Board_REVB:IU2405SA; OC_FARNELL: 1435422
U30 = texas:ISO3082; OC_FARNELL: 1755040
ZD1 = praxe:TL431: Napetova reference